# Altium schematic sheet RPI_HAT_Flash_00.SchDoc: RPi Camera Flash HAT
size A3; Date: 28-01-2015; DrawnBy: Wim Van Gool; Revision: 00; SheetNumber: 1; SheetTotal: 1
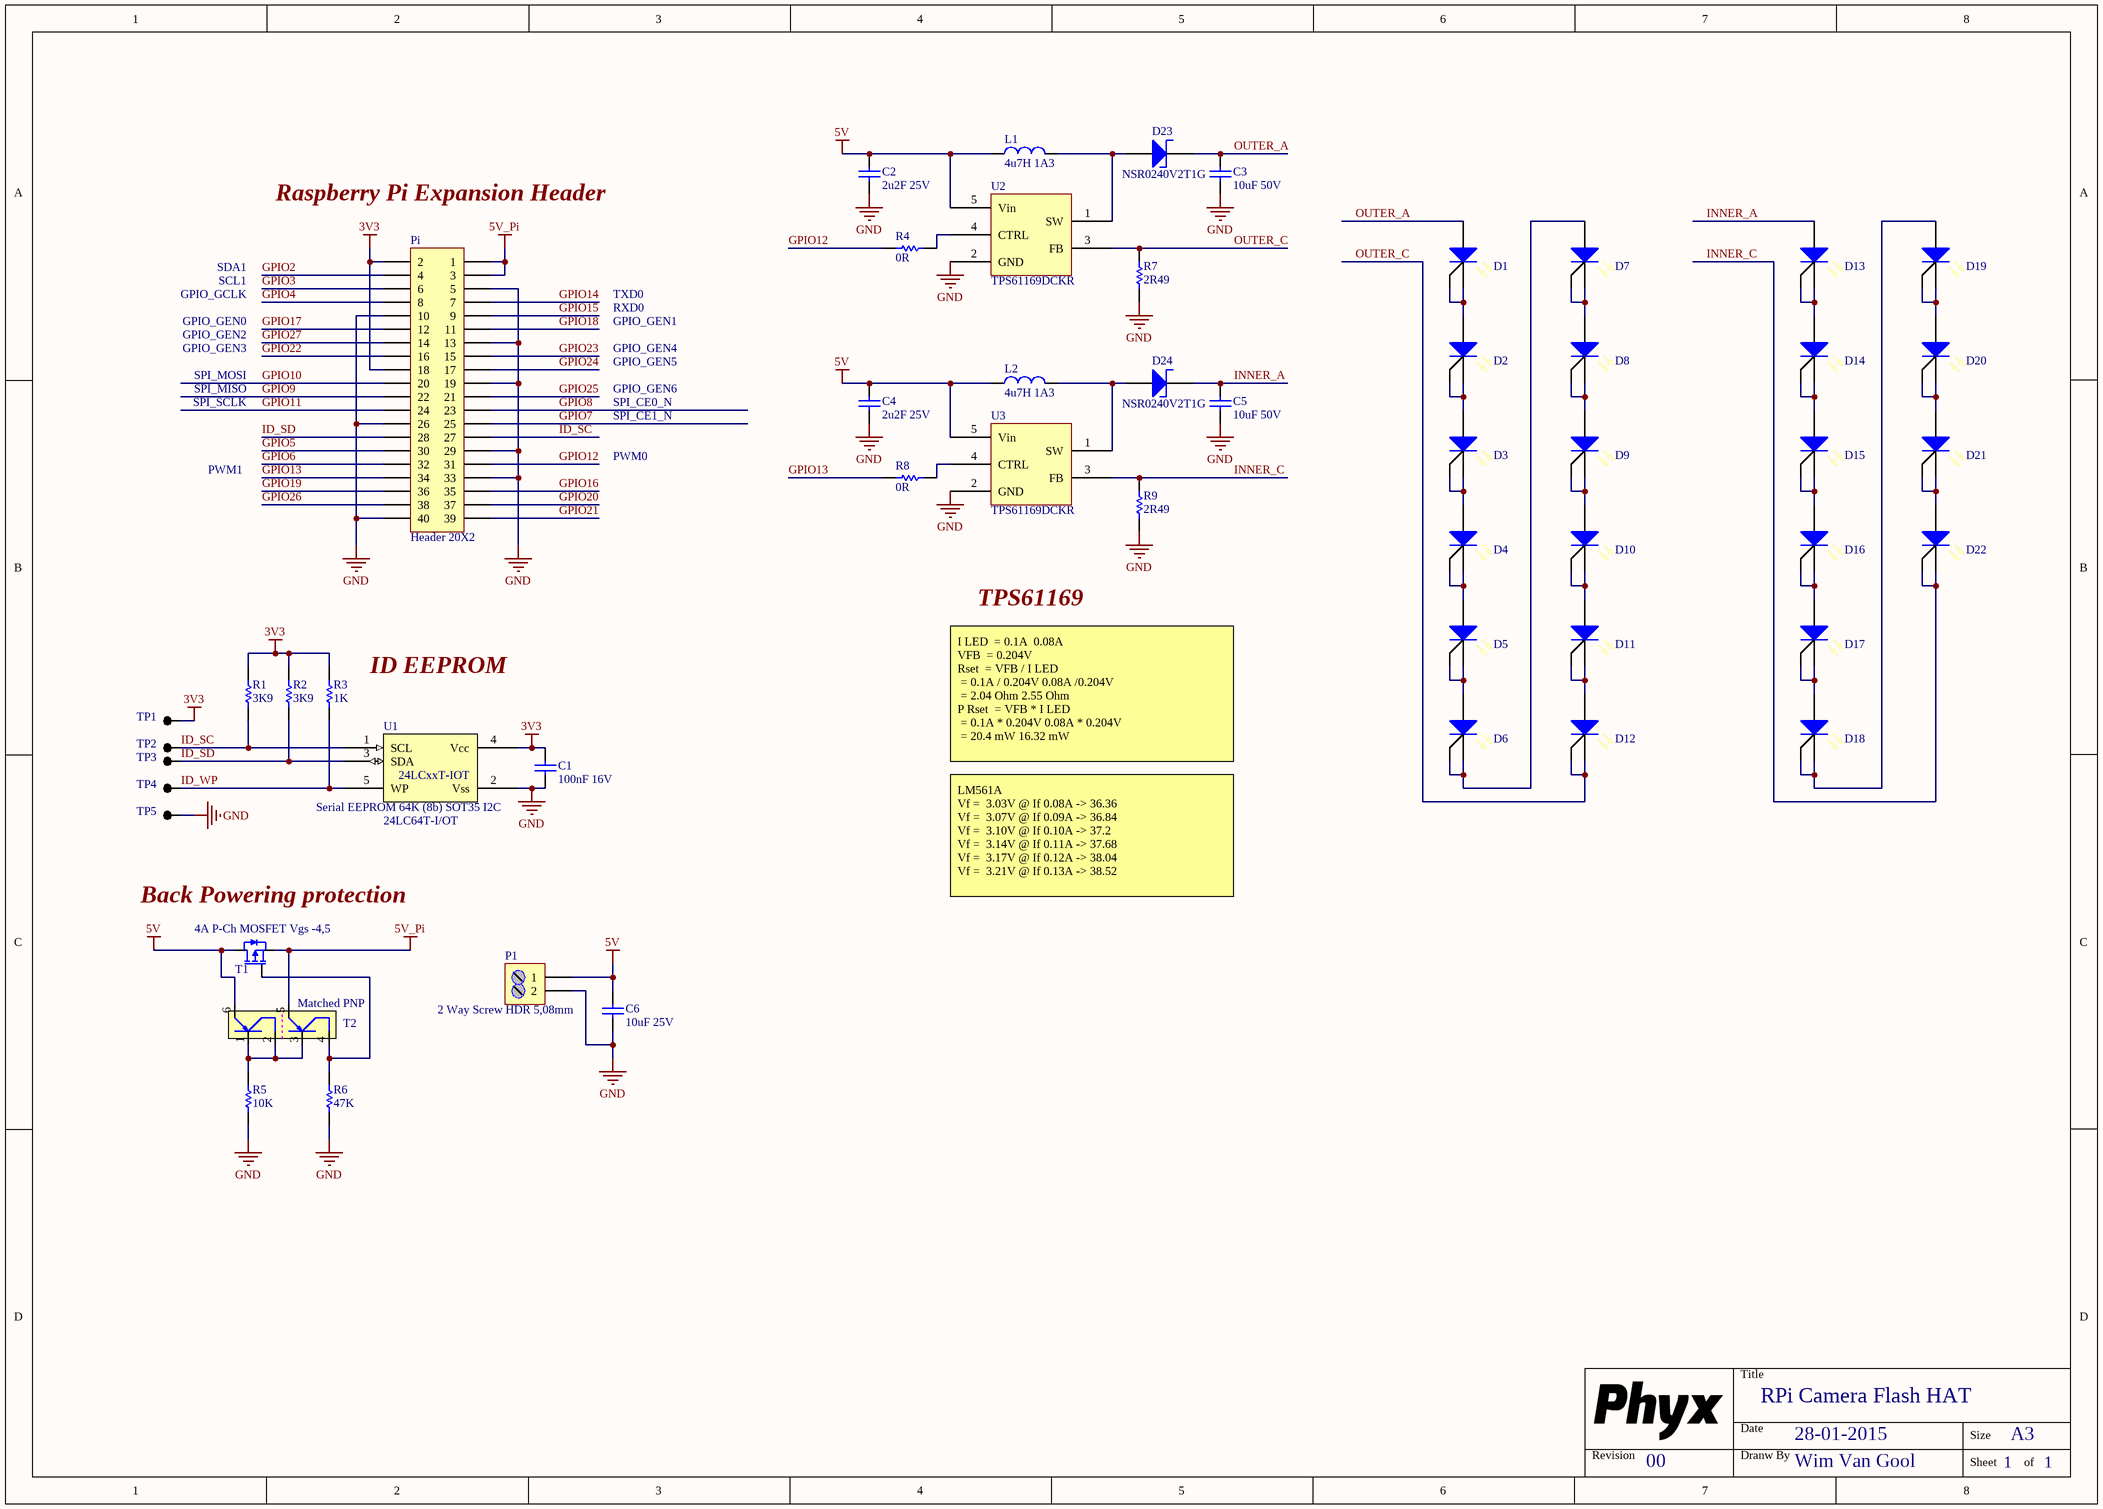
[diagram p0: RPI_HAT_Flash_00.SchDoc]

## Parts
C1  value 100nF 16V  [C0603]  (hidden comment: CAP_CERAMIC)
C2  value 2u2F 25V  [C0805]  (hidden comment: CAP_CERAMIC)
C3  value 10uF 50V  [C1206]  (hidden comment: CAP_CERAMIC)
C4  value 2u2F 25V  [C0805]  (hidden comment: CAP_CERAMIC)
C5  value 10uF 50V  [C1206]  (hidden comment: CAP_CERAMIC)
C6  value 10uF 25V  [C1206]  (hidden comment: CAP_CERAMIC)
D1  5630 LM561A Samsung LED  [LED_LM561A]  (value not drawn)
D2  5630 LM561A Samsung LED  [LED_LM561A]  (value not drawn)
D3  5630 LM561A Samsung LED  [LED_LM561A]  (value not drawn)
D4  5630 LM561A Samsung LED  [LED_LM561A]  (value not drawn)
D5  5630 LM561A Samsung LED  [LED_LM561A]  (value not drawn)
D6  5630 LM561A Samsung LED  [LED_LM561A]  (value not drawn)
D7  5630 LM561A Samsung LED  [LED_LM561A]  (value not drawn)
D8  5630 LM561A Samsung LED  [LED_LM561A]  (value not drawn)
D9  5630 LM561A Samsung LED  [LED_LM561A]  (value not drawn)
D10  5630 LM561A Samsung LED  [LED_LM561A]  (value not drawn)
D11  5630 LM561A Samsung LED  [LED_LM561A]  (value not drawn)
D12  5630 LM561A Samsung LED  [LED_LM561A]  (value not drawn)
D13  5630 LM561A Samsung LED  [LED_LM561A]  (value not drawn)
D14  5630 LM561A Samsung LED  [LED_LM561A]  (value not drawn)
D15  5630 LM561A Samsung LED  [LED_LM561A]  (value not drawn)
D16  5630 LM561A Samsung LED  [LED_LM561A]  (value not drawn)
D17  5630 LM561A Samsung LED  [LED_LM561A]  (value not drawn)
D18  5630 LM561A Samsung LED  [LED_LM561A]  (value not drawn)
D19  5630 LM561A Samsung LED  [LED_LM561A]  (value not drawn)
D20  5630 LM561A Samsung LED  [LED_LM561A]  (value not drawn)
D21  5630 LM561A Samsung LED  [LED_LM561A]  (value not drawn)
D22  5630 LM561A Samsung LED  [LED_LM561A]  (value not drawn)
D23  value NSR0240V2T1G  [ON_SOD-523]  (hidden comment: NSR0240V2T1G Schottky ULTRAFAST, 200MA, 40V)
D24  value NSR0240V2T1G  [ON_SOD-523]  (hidden comment: NSR0240V2T1G Schottky ULTRAFAST, 200MA, 40V)
L1  value 4u7H 1A3  [LPS4018]  (hidden comment: LPS4018-472MRB)
L2  value 4u7H 1A3  [LPS4018]  (hidden comment: LPS4018-472MRB)
P1  2 Way Screw HDR 5,08mm  [TERM_BLK-0508-2-90]
Pi  Header 20X2  [RCPT2X20]
R1  value 3K9  [R0603]  (hidden comment: RESISTOR)
R2  value 3K9  [R0603]  (hidden comment: RESISTOR)
R3  value 1K  [R0603]  (hidden comment: RESISTOR)
R4  value 0R  [R0603]  (hidden comment: RESISTOR)
R5  value 10K  [R0603]  (hidden comment: RESISTOR)
R6  value 47K  [R0603]  (hidden comment: RESISTOR)
R7  value 2R49  [R0603]  (hidden comment: RESISTOR)
R8  value 0R  [R0603]  (hidden comment: RESISTOR)
R9  value 2R49  [R0603]  (hidden comment: RESISTOR)
T1  4A P-Ch MOSFET Vgs -4,5  [SOT23-3]
T2  Matched PNP  [SOT23-6]
TP1  TEST_PAD  [TP_1.2mm_0.6mm]  (value not drawn)
TP2  TEST_PAD  [TP_1.2mm_0.6mm]  (value not drawn)
TP3  TEST_PAD  [TP_1.2mm_0.6mm]  (value not drawn)
TP4  TEST_PAD  [TP_1.2mm_0.6mm]  (value not drawn)
TP5  TEST_PAD  [TP_1.2mm_0.6mm]  (value not drawn)
U1  Serial EEPROM 64K (8b) SOT35 I2C  value 24LC64T-I/OT  [SOT23-5]
U2  value TPS61169DCKR  [TI-DCK-R-PDSO-G5]  (hidden comment: TPS61169 38-V Boost WLED Driver with PWM)
U3  value TPS61169DCKR  [TI-DCK-R-PDSO-G5]  (hidden comment: TPS61169 38-V Boost WLED Driver with PWM)

## Nets
3V3: C1.1 Pi.2 Pi.18 R1.1 R2.1 R3.1 TP1.1 U1.4(Vcc)
5V: C2.1 C4.1 C6.1 L1.1 L2.1 P1.1 T1.3(D) T2.6(E) U2.5(Vin) U3.5(Vin)
5V_Pi: Pi.1 Pi.3 T1.2(S) T2.5(E)
GND: C1.2 C2.2 C3.2 C4.2 C5.2 C6.2 P1.2 Pi.5 Pi.10 Pi.13 Pi.19 Pi.26 Pi.29 Pi.33 Pi.40 R5.2 R6.2 R7.2 R9.2 TP5.1 U1.2(Vss) U2.2(GND) U3.2(GND)
GPIO2: Pi.4
GPIO3: Pi.6
GPIO4: Pi.8
GPIO5: Pi.30
GPIO6: Pi.32
GPIO7: Pi.25
GPIO8: Pi.23
GPIO9: Pi.22
GPIO10: Pi.20
GPIO11: Pi.24
GPIO12: Pi.31 R4.2
GPIO13: Pi.34 R8.2
GPIO14: Pi.7
GPIO15: Pi.9
GPIO16: Pi.35
GPIO17: Pi.12
GPIO18: Pi.11
GPIO19: Pi.36
GPIO20: Pi.37
GPIO21: Pi.39
GPIO22: Pi.16
GPIO23: Pi.15
GPIO24: Pi.17
GPIO25: Pi.21
GPIO26: Pi.38
GPIO27: Pi.14
ID_SC: Pi.27 R1.2 TP2.1 U1.1(SCL)
ID_SD: Pi.28 R2.2 TP3.1 U1.3(SDA)
ID_WP: R3.2 TP4.1 U1.5(WP)
INNER_A: C5.1 D13.1(A) D24.1(C)
INNER_C: D22.2(K) D22.3(K) R9.1 U3.3(FB)
OUTER_A: C3.1 D1.1(A) D23.1(C)
OUTER_C: D12.2(K) D12.3(K) R7.1 U2.3(FB)
NetD1_2: D1.2(K) D1.3(K) D2.1(A)
NetD2_2: D2.2(K) D2.3(K) D3.1(A)
NetD3_2: D3.2(K) D3.3(K) D4.1(A)
NetD4_2: D4.2(K) D4.3(K) D5.1(A)
NetD5_2: D5.2(K) D5.3(K) D6.1(A)
NetD6_2: D6.2(K) D6.3(K) D7.1(A)
NetD7_2: D7.2(K) D7.3(K) D8.1(A)
NetD8_2: D8.2(K) D8.3(K) D9.1(A)
NetD9_2: D9.2(K) D9.3(K) D10.1(A)
NetD10_2: D10.2(K) D10.3(K) D11.1(A)
NetD11_2: D11.2(K) D11.3(K) D12.1(A)
NetD13_2: D13.2(K) D13.3(K) D14.1(A)
NetD14_2: D14.2(K) D14.3(K) D15.1(A)
NetD15_2: D15.2(K) D15.3(K) D16.1(A)
NetD16_2: D16.2(K) D16.3(K) D17.1(A)
NetD17_2: D17.2(K) D17.3(K) D18.1(A)
NetD18_2: D18.2(K) D18.3(K) D19.1(A)
NetD19_2: D19.2(K) D19.3(K) D20.1(A)
NetD20_2: D20.2(K) D20.3(K) D21.1(A)
NetD21_2: D21.2(K) D21.3(K) D22.1(A)
NetD23_2: D23.2(A) L1.2 U2.1(SW)
NetD24_2: D24.2(A) L2.2 U3.1(SW)
NetR4_1: R4.1 U2.4(CTRL)
NetR5_1: R5.1 T2.1(B) T2.2(C) T2.3(B)
NetR6_1: R6.1 T1.1(G) T2.4(C)
NetR8_1: R8.1 U3.4(CTRL)

## Notes on the sheet
- Raspberry Pi Expansion Header
- SDA1
- SCL1
- GPIO_GCLK
- TXD0
- RXD0
- GPIO_GEN0
- GPIO_GEN2
- GPIO_GEN3
- SPI_MOSI
- GPIO_GEN1
- GPIO_GEN4
- GPIO_GEN5
- SPI_MISO
- SPI_SCLK
- GPIO_GEN6
- SPI_CE0_N
- SPI_CE1_N
- PWM1
- PWM0
- TPS61169
- (near R3) ID EEPROM
- I LED 	= 0.1A		0.08A
  VFB 	= 0.204V
  Rset 	= VFB / I LED
  = 0.1A / 0.204V	0.08A /0.204V
  = 2.04 Ohm	2.55 Ohm
  P Rset 	= VFB * I LED
  = 0.1A * 0.204V	0.08A * 0.204V
  = 20.4 mW	16.32 mW
- (near T1) Back Powering protection
- LM561A
  Vf =  3.03V @ If 0.08A -> 36.36
  Vf =  3.07V @ If 0.09A -> 36.84
  Vf =  3.10V @ If 0.10A -> 37.2
  Vf =  3.14V @ If 0.11A -> 37.68
  Vf =  3.17V @ If 0.12A -> 38.04
  Vf =  3.21V @ If 0.13A -> 38.52
- Title
- Revision
- Date
- Dranw By
- Size
- A3
- Sheet
- of

## Library data of the parts
C1 = CAP # 100nF 16V 0603: Capacitor Ceramic
C2 C4 = CAP # 2u2F 25V 0805: Capacitor Ceramic; Supplier 1: Farnell; Supplier Part Number 1: 2320829
C3 C5 = CAP # 10uF 50V 1206: Capacitor Ceramic; Supplier 1: Farnell; Supplier Part Number 1: 2382682
C6 = CAP # 10uF 25V 1206: Capacitor Ceramic; Supplier 1: Farnell; Supplier Part Number 1: 2320887
D1-D22 = LED # LM561A: =Description
D23 D24 = Schottky NSR0240V2T1G: =Description; Supplier 1: Farnell; Supplier Part Number 1: 2317403
L1 L2 = IND # 4u7H 1A3 LPS4018: Supplier 1: Farnell; Supplier Part Number 1: 2408103
P1 = Terminal Block 5,08mm 2way: Value: PM5.08/2/90; Supplier 1: Farnell
Pi = Receptable 2.54mm dual row 40way: =Description
R1 R2 = RES # 3K9 0603
R3 = RES # 1K 0603
R4 R8 = RES # 0R 0603
R5 = RES # 10K 0603
R6 = RES # 47K 0603
R7 R9 = RES # 2R49 0603: Supplier 1: Farnell; Supplier Part Number 1: 2141525
T1 = TSM2311CX P-Ch MOSFET 4A: =Description; Value: TSM2311CX; Supplier 1: Farnell; Supplier Part Number 1: 1864586
T2 = DMMT5401-7-F matched PNP: Value: DMMT5401-7-F; Supplier 1: Farnell; Supplier Part Number 1: 1773583
TP1-TP5 = TP 1.2mm: Value: NO BOM
U1 = EEPROM # I2C 8Kx8b 24LC64T-I/OT: =Description; Supplier 1: Farnell; Supplier Part Number 1: 1700992
U2 U3 = LED_DRVR # TPS61169: =Description